# EAGLE design Tesseract_Pro-Mini (EAGLE 7.7.0)
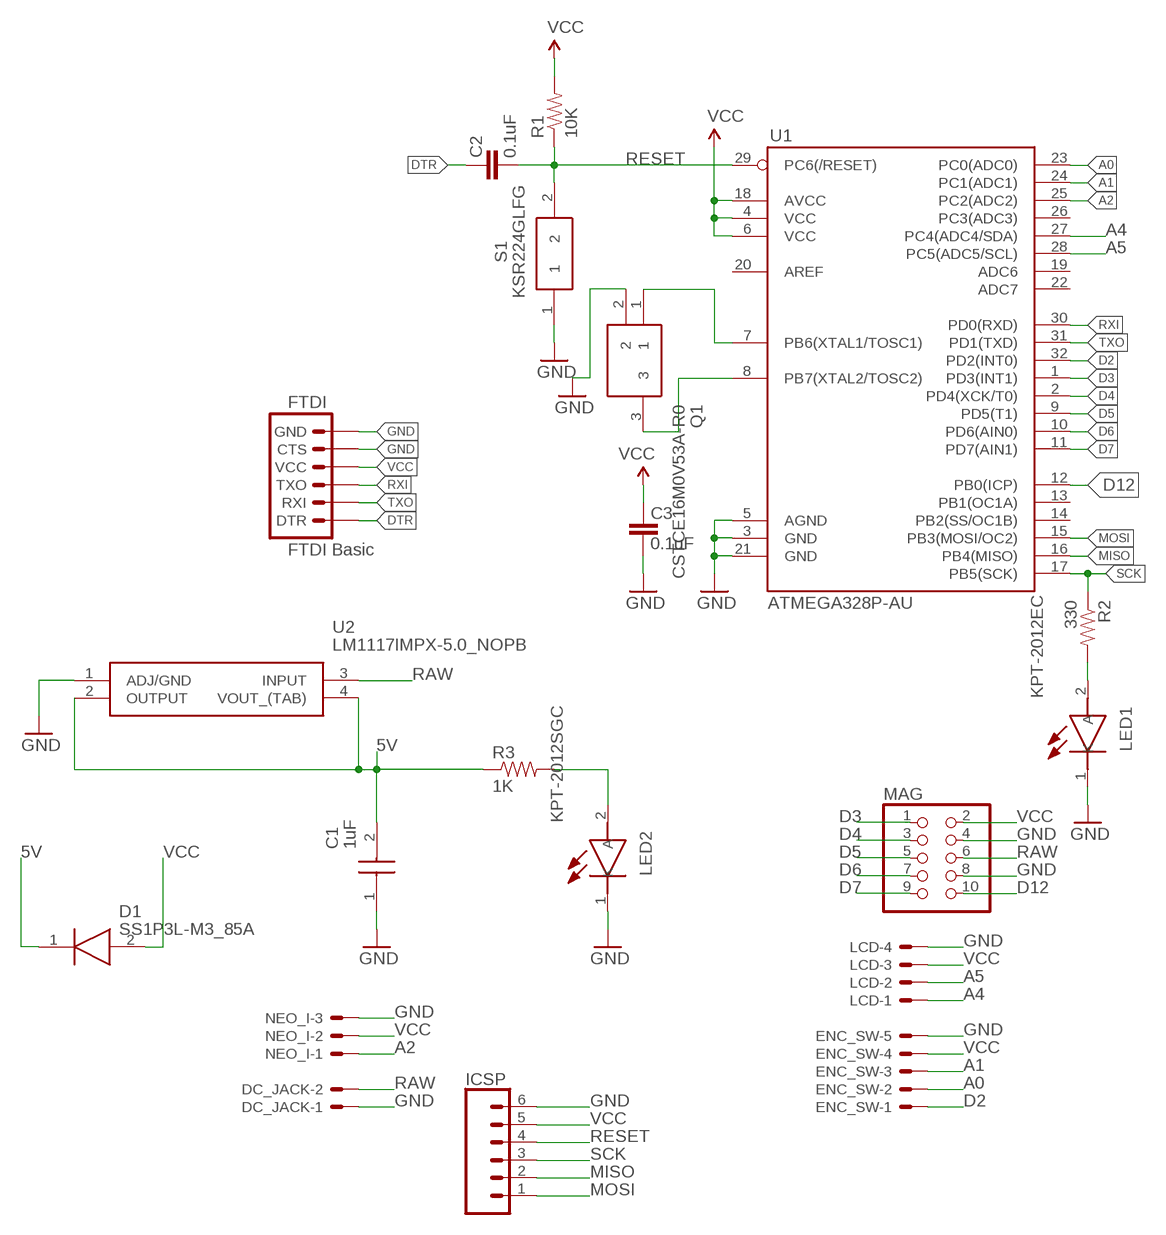
[diagram p0: schematic, sheet 1]

## Parts
C1  1uF  GRM188R61E105KA12D  [CAPC1608X90N]
C2  0.1uF  CAP0603-CAP  [0603-CAP]
C3  0.1uF  CAP0603-CAP  [0603-CAP]
D1  SS1P3L-M3_85A  [SMP]
DC_JACK  JST-XH-02-PIN-LONG-PAD  [JST-XH-02-PACKAGE-LONG-PAD]
ENC_SW  JST-XH-05-PIN-LONG-PAD  [JST-XH-05-PACKAGE-LONG-PAD]
FTDI  FTDI Basic  ARDUINO_SERIAL_PROGRAMPTH  [1X06]
ICSP  CONN_06NO_SILK_NO_POP  [1X06_NO_SILK]
LCD  JST-XH-04-PIN-LONG-PAD  [JST-XH-04-PACKAGE-LONG-PAD]
LED1  KPT-2012EC  [LEDC2012X75N]
LED2  KPT-2012SGC  [LEDM2012X120N]
MAG  PINHD-2X5  [2X05]
NEO_I  JST-XH-03-PIN-LONG-PAD  [JST-XH-03-PACKAGE-LONG-PAD]
Q1  CSTCE16M0V53A-R0  [CSTCE-V_1]
R1  10K  RESISTOR0603-RES  [0603-RES]
R2  330  RESISTOR0603-RES  [0603-RES]
R3  1K  RESISTOR0603-RES  [0603-RES]
S1  KSR224GLFG  [KSR211GLFS]
U1  ATMEGA328P-AU  ATMEGA168  [TQFP32-08]
U2  LM1117IMPX-5.0_NOPB  [SOT230P700X180-4N]

## Nets
5V: C1.2 D1.1(A) R3.1 U2.2(OUTPUT) U2.4(VOUT_(TAB))
A0: ENC_SW.2 U1.23(PC0(ADC0))
A1: ENC_SW.3 U1.24(PC1(ADC1))
A2: NEO_I.1 U1.25(PC2(ADC2))
A4: LCD.1 U1.27(PC4(ADC4/SDA))
A5: LCD.2 U1.28(PC5(ADC5/SCL))
D2: ENC_SW.1 U1.32(PD2(INT0))
D3: MAG.1 U1.1(PD3(INT1))
D4: MAG.3 U1.2(PD4(XCK/T0))
D5: MAG.5 U1.9(PD5(T1))
D6: MAG.7 U1.10(PD6(AIN0))
D7: MAG.9 U1.11(PD7(AIN1))
D12: MAG.10 U1.12(PB0(ICP))
DTR: C2.2 FTDI.1(DTR)
GND [vcc]: C1.1 C3.1 DC_JACK.1 ENC_SW.5 FTDI.5(CTS) FTDI.6(GND) ICSP.6 LCD.4 LED1.1(K) LED2.1(K) MAG.4 MAG.8 NEO_I.3 Q1.2 S1.1 U1.3(GND) U1.5(AGND) U1.21(GND) U2.1(ADJ/GND)
MISO: ICSP.2 U1.16(PB4(MISO))
MOSI: ICSP.1 U1.15(PB3(MOSI/OC2))
N$1: Q1.1 U1.7(PB6(XTAL1/TOSC1))
N$2: Q1.3 U1.8(PB7(XTAL2/TOSC2))
N$3: LED2.2(A) R3.2
N$4: LED1.2(A) R2.2
RAW [vcc]: DC_JACK.2 MAG.6 U2.3(INPUT)
RESET: C2.1 ICSP.4 R1.1 S1.2 U1.29(PC6(/RESET))
RXI: FTDI.3(TXO) U1.30(PD0(RXD))
SCK: ICSP.3 R2.1 U1.17(PB5(SCK))
TXO: FTDI.2(RXI) U1.31(PD1(TXD))
VCC: C3.2 D1.2(K) ENC_SW.4 FTDI.4(VCC) ICSP.5 LCD.3 MAG.2 NEO_I.2 R1.2 U1.4(VCC) U1.6(VCC) U1.18(AVCC)
Unconnected: U1.13(PB1(OC1A)) U1.14(PB2(SS/OC1B)) U1.19(ADC6) U1.20(AREF) U1.22(ADC7) U1.26(PC3(ADC3))

## Library data of the parts
C1 = SamacSys_Parts:GRM188R61E105KA12D: Ceramic SMT capacitor 1uF 25Vdc Murata 0603 GRM 1??F Ceramic Multilayer Capacitor, 25 V dc X5R Dielectric ??10% Source: Datasheet <http://psearch.en.murata.com/capacitor/product/GRM188R61E105KA12#.pdf>; ARROW_PART_NUMBER: GRM188R61E105KA12D; ARROW_PRICE/STOCK: https://www.arrow.com/en/products/grm188r61e105ka12d/murata-manufacturing; DESCRIPTION: Ceramic SMT capacitor 1uF 25Vdc Murata 0603 GRM 1??F Ceramic Multilayer Capacitor, 25 V dc X5R Dielectric ??10%; HEIGHT: 0.9mm; MANUFACTURER_NAME: Murata Electronics; MANUFACTURER_PART_NUMBER: GRM188R61E105KA12D; RS_PART_NUMBER: 7235587P; RS_PRICE/STOCK: http://uk.rs-online.com/web/p/products/7235587P
C2 C3 = SparkFun:CAP: Capacitor Standard 0603 ceramic capacitor, and 0.1" leaded capacitor.
D1 = SamacSys_Parts:SS1P3L-M3_85A: Schottky Diodes & Rectifiers 30volt 1.0amp Source: Datasheet <https://www.vishay.com/docs/88915/ss1p3l.pdf>; ARROW_PART_NUMBER: SS1P3L-M3/85A; ARROW_PRICE/STOCK: https://www.arrow.com/en/products/ss1p3l-m385a/vishay; DESCRIPTION: Schottky Diodes & Rectifiers 30volt 1.0amp; HEIGHT: mm; MANUFACTURER_NAME: Vishay; MANUFACTURER_PART_NUMBER: SS1P3L-M3/85A
DC_JACK = Rembrandt Electronics - JST XH Connectors v1-0:JST-XH-02-PIN: JST XH Connector 2 Pin Wire to board connector. Pitch: 2,54 mm, (0.100") Number of pins: 2 Created by Rembrandt Electronics www.rembrandtelectronics.com
ENC_SW = Rembrandt Electronics - JST XH Connectors v1-0:JST-XH-05-PIN: JST XH Connector 2 Pin Wire to board connector. Pitch: 2,54 mm, (0.100") Number of pins: 5 Created by Rembrandt Electronics www.rembrandtelectronics.com
FTDI = SparkFun:ARDUINO_SERIAL_PROGRAM
ICSP = SparkFun-Connectors:CONN_06: Multi connection point. Often used as Generic Header-pin footprint for 0.1 inch spaced/style header connections On any of the 0.1 inch spaced packages, you can populate with these: Break Away Headers - Straight <https://www.sparkfun.com/products/116> (PRT-00116) Break Away Male Headers - Right Angle <https://www.sparkfun.com/products/553> (PRT-00553) Female Headers <https://www.sparkfun.com/products/115> (PRT-00115) Break Away Headers - Machine Pin <https://www.sparkfun.com/products/117> (PRT-00117) Break Away Female Headers - Swiss Machine Pin <https://www.sparkfun.com/products/743> (PRT-00743) Arduino Stackable Header - 6 Pin <https://www.sparkfun.com/products/9280> (PRT-09280) For SCREWTERMINALS and SPRING TERMINALS visit here: Screw Terimnals on SparkFun.com <https://www.sparkfun.com/search/results?term=Screw+Terminals> (5mm/3.5mm/2.54mm spacing) This device is also useful as a general connection point to wire up your design to another part of your project. Our various solder wires solder well into these plated through hole pads. Hook-Up Wire - Assortment (Stranded, 22 AWG) <https://www.sparkfun.com/products/11375> (PRT-11375) Hook-Up Wire - Assortment (Solid Core, 22 AWG) <https://www.sparkfun.com/products/11367> (PRT-11367) View the entire wire category on our website here <https://www.sparkfun.com/categories/141>
LCD = Rembrandt Electronics - JST XH Connectors v1-0:JST-XH-04-PIN: JST XH Connector 2 Pin Wire to board connector. Pitch: 2,54 mm, (0.100") Number of pins: 4 Created by Rembrandt Electronics www.rembrandtelectronics.com
LED1 = SamacSys_Parts:KPT-2012EC: Kingbright KPT-2012EC Red LED, 617 nm, 2012 (0805), Rectangle Lens SMD Package Source: Datasheet <http://uk.rs-online.com/web/p/products/8610175>; ARROW_PART_NUMBER: KPT-2012EC; ARROW_PRICE/STOCK: http://uk.rs-online.com/web/p/products/1651842; DESCRIPTION: Kingbright KPT-2012EC Red LED, 617 nm, 2012 (0805), Rectangle Lens SMD Package; HEIGHT: 0.75mm; MANUFACTURER_NAME: Kingbright; MANUFACTURER_PART_NUMBER: KPT-2012EC; RS_PART_NUMBER: 1651842; RS_PRICE/STOCK: http://uk.rs-online.com/web/p/products/1651842
LED2 = SamacSys_Parts:KPT-2012SGC: Kingbright KPT-2012SGC Green LED, 568 nm, 2012 (0805), Rectangle Lens SMD Package Source: Datasheet <https://componentsearchengine.com/Datasheets/2/KPT-2012SGC.pdf>; ARROW_PART_NUMBER: KPT-2012SGC; ARROW_PRICE/STOCK: http://uk.rs-online.com/web/p/products/8610188; DESCRIPTION: Kingbright KPT-2012SGC Green LED, 568 nm, 2012 (0805), Rectangle Lens SMD Package; HEIGHT: 1.2mm; MANUFACTURER_NAME: Kingbright; MANUFACTURER_PART_NUMBER: KPT-2012SGC; RS_PART_NUMBER: 8610188; RS_PRICE/STOCK: http://uk.rs-online.com/web/p/products/8610188
MAG = POGO:PINHD-2X5: PIN HEADER
NEO_I = Rembrandt Electronics - JST XH Connectors v1-0:JST-XH-03-PIN: JST XH Connector 2 Pin Wire to board connector. Pitch: 2,54 mm, (0.100") Number of pins: 3 Created by Rembrandt Electronics www.rembrandtelectronics.com
Q1 = SamacSys_Parts:CSTCE16M0V53A-R0: CSTCE16M0V53A-R0, Ceramic Resonator, 16MHz Fundamental 15pF, 3-Pin Cap Chip, 3.2 x 1.3 x 0.9mm Source: Datasheet <http://docs-europe.electrocomponents.com/webdocs/0ef2/0900766b80ef2ca9.pdf>; ARROW_PART_NUMBER: CSTCE16M0V53A-R0; ARROW_PRICE/STOCK: https://www.arrow.com/en/products/cstce16m0v53a-r0/murata-manufacturing; DESCRIPTION: CSTCE16M0V53A-R0, Ceramic Resonator, 16MHz Fundamental 15pF, 3-Pin Cap Chip, 3.2 x 1.3 x 0.9mm; HEIGHT: mm; MANUFACTURER_NAME: Murata Electronics; MANUFACTURER_PART_NUMBER: CSTCE16M0V53A-R0; RS_PART_NUMBER: 1669524; RS_PRICE/STOCK: http://uk.rs-online.com/web/p/products/1669524
R1-R3 = SparkFun:RESISTOR: Resistor Basic schematic elements and footprints for 0603, 1206, and PTH resistors.
S1 = SamacSys_Parts:KSR224GLFG: KSR224GLFG (Tactile Switches) Source: Datasheet <https://www.ckswitches.com/media/1466/ksr.pdf>; ARROW_PART_NUMBER: KSR224GLFG; DESCRIPTION: KSR224GLFG (Tactile Switches); HEIGHT: mm; MANUFACTURER_NAME: C & K COMPONENTS; MANUFACTURER_PART_NUMBER: KSR224GLFG
U1 = SparkFun:ATMEGA168; DESCRIPTION: MICROCHIP - ATMEGA328P-AU. - MICROCONTROLLER MCU, 8 BIT, ATMEGA, 20MHZ, TQFP-32; MANUFACTURER: Microchip; PART_NUMBER: ATMEGA328P-AU; RS_PART_NUMBER: 1310271
U2 = SamacSys_Parts:LM1117IMPX-5.0_NOPB: Space Saving 800mA Low-Dropout Linear Regulator with Internal Current Limit Source: Datasheet <http://www.ti.com/lit/gpn/lm1117>; ARROW_PART_NUMBER: LM1117IMPX-5.0/NOPB; ARROW_PRICE/STOCK: https://www.arrow.com/en/products/lm1117impx-5.0nopb/texas-instruments; DESCRIPTION: Space Saving 800mA Low-Dropout Linear Regulator with Internal Current Limit; HEIGHT: 1.8mm; MANUFACTURER_NAME: Texas Instruments; MANUFACTURER_PART_NUMBER: LM1117IMPX-5.0/NOPB

## Net classes
0 default: width 0.203 mm
1 vcc: width 0.254 mm

## Board
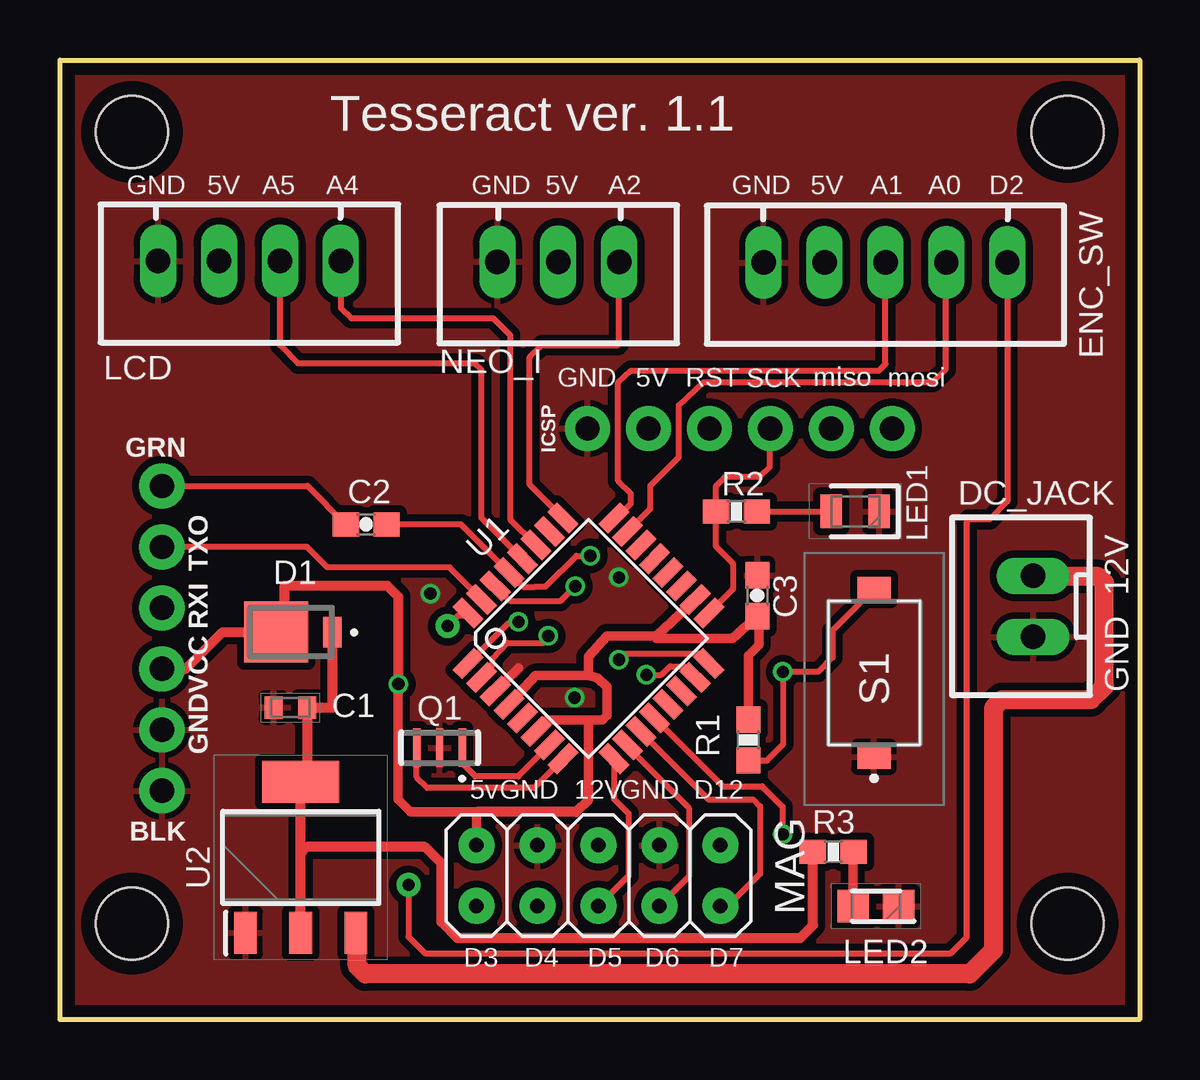
[diagram p1: board, top side]
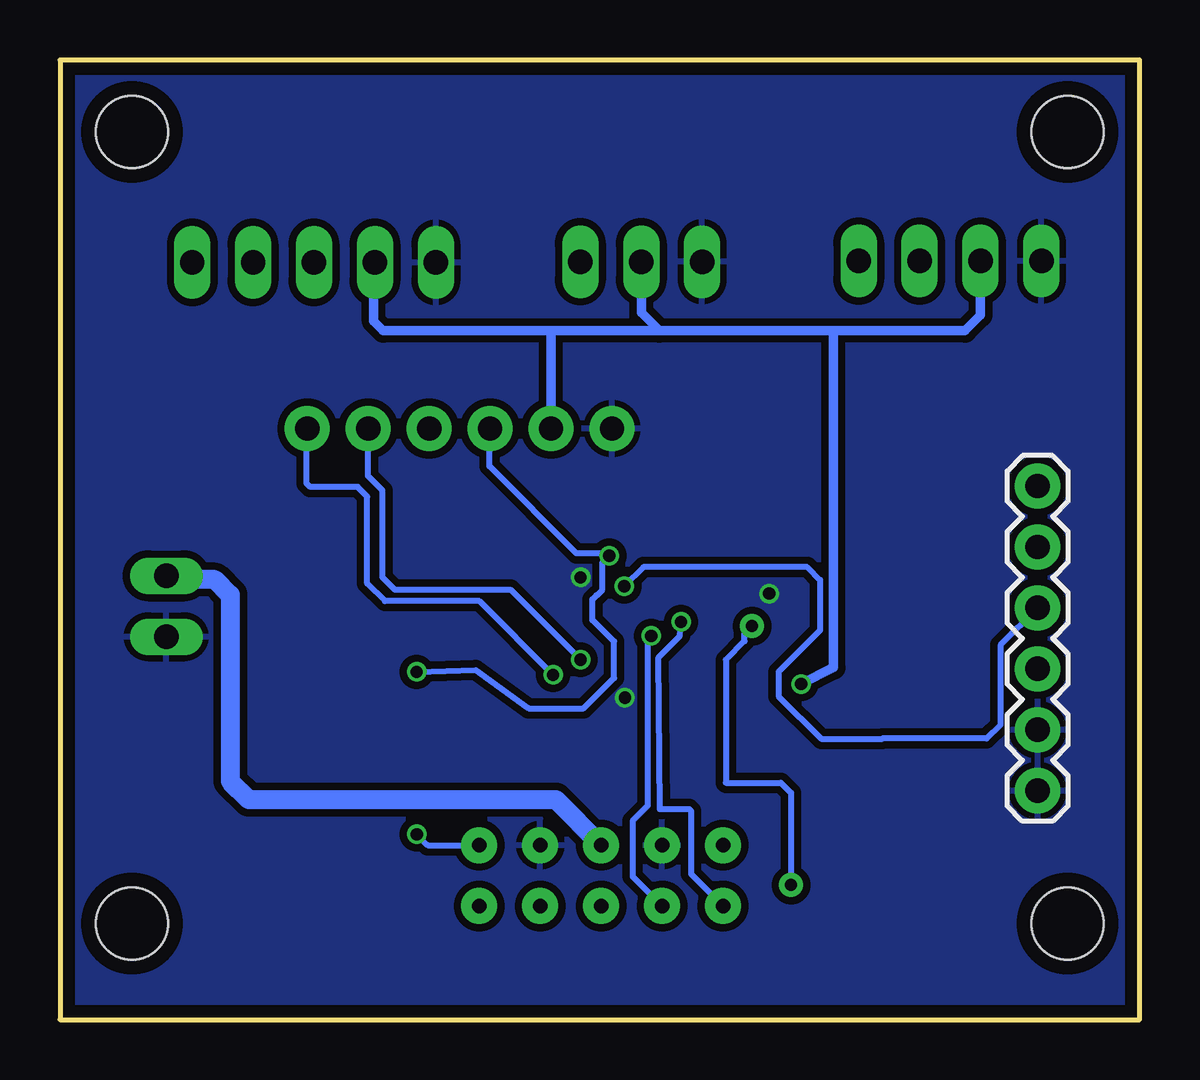
[diagram p2: board, bottom side, seen from below]

Size 45 x 40 mm. Coordinates in mm from the lower left corner, seen from the top.
Outline: 0,40 45,40 45,0 0,0 0,40
Copper layers (1*16): Top 0.035mm / dielectric 1.6mm / Bottom 0.035mm
Design rules "Elecrow_2-layer_PCB_eagle_rule": minimum track width 6mil, minimum drill 12mil, track to track 6mil, track to pad 6mil, pad to pad 6mil, via to via 8mil, smd to smd 0mil, copper to edge 20mil, drill to drill 10mil, minimum pad ring 6mil, minimum via ring 6mil, stop-mask expansion 0mil, vias tented up to drill 100mil, thermal gap 10mil
Holes 3 mm at 3,4 42,4 42,37 3,37
tRestrict: area 40.5,2.5 to 43.5,5.5; area 40.5,35.5 to 43.5,38.5; area 1.5,35.5 to 4.5,38.5; area 1.5,2.5 to 4.5,5.5
bRestrict: area 1.5,2.5 to 4.5,5.5; area 1.5,35.5 to 4.5,38.5; area 40.5,2.5 to 43.5,5.5; area 40.5,35.5 to 43.5,38.5

### Footprints (pad centres in the part's own frame; a part is rotated, then mirrored left to right if it is on the bottom)
CAPC1608X90N = smd 0.75 x 0.94: 1 -0.7,0; 2 0.7,0
0603-CAP = smd 1.1 x 1: 1 -0.85,0; 2 0.85,0
SMP = smd 0.762 x 1.27: 1 0.03,0 | smd 2.67 x 2.54: 2 -2.321,0
JST-XH-02-PACKAGE-LONG-PAD = drill 1.016 long: 1 -1.27,0; 2 1.27,0
JST-XH-05-PACKAGE-LONG-PAD = drill 1.016 long: 1 -5.08,0; 2 -2.54,0; 3 0,0; 4 2.54,0; 5 5.08,0
1X06 = drill 1.016 pad 1.88: 1 0,0; 2 2.54,0; 3 5.08,0; 4 7.62,0; 5 10.16,0; 6 12.7,0
1X06_NO_SILK = drill 1.016 pad 1.88: 1 0,0; 2 2.54,0; 3 5.08,0; 4 7.62,0; 5 10.16,0; 6 12.7,0
JST-XH-04-PACKAGE-LONG-PAD = drill 1.016 long: 1 -3.81,0; 2 -1.27,0; 3 1.27,0; 4 3.81,0
LEDC2012X75N = smd 0.9 x 1.4: 1 -1,0; 2 1,0
LEDM2012X120N = smd 1.3 x 1.35: 1 -0.95,0; 2 0.95,0
2X05 = drill 0.6 pad 1.5: 1 -5.08,-1.27; 2 -5.08,1.27; 3 -2.54,-1.27; 4 -2.54,1.27; 5 0,-1.27; 6 0,1.27; 7 2.54,-1.27; 8 2.54,1.27; 9 5.08,-1.27; 10 5.08,1.27
JST-XH-03-PACKAGE-LONG-PAD = drill 1.016 long: 1 -2.54,0; 2 0,0; 3 2.54,0
CSTCE-V_1 = smd 0.3 x 1.6: 1 -0.95,0; 2 0,0; 3 0.95,0
0603-RES = smd 1.1 x 1: 1 -0.85,0; 2 0.85,0
KSR211GLFS = smd 1 x 1.4: 1 -3.5,0; 2 3.5,0
TQFP32-08 = smd 1.27 x 0.559: 1 -4.293,2.8; 2 -4.293,2; 3 -4.293,1.2; 4 -4.293,0.4; 5 -4.293,-0.4; 6 -4.293,-1.2; 7 -4.293,-2; 8 -4.293,-2.8; 17 4.293,-2.8; 18 4.293,-2; 19 4.293,-1.2; 20 4.293,-0.4; 21 4.293,0.4; 22 4.293,1.2; 23 4.293,2; 24 4.293,2.8 | smd 0.559 x 1.27: 9 -2.8,-4.293; 10 -2,-4.293; 11 -1.2,-4.293; 12 -0.4,-4.293; 13 0.4,-4.293; 14 1.2,-4.293; 15 2,-4.293; 16 2.8,-4.293; 25 2.8,4.293; 26 2,4.293; 27 1.2,4.293; 28 0.4,4.293; 29 -0.4,4.293; 30 -1.2,4.293; 31 -2,4.293; 32 -2.8,4.293
SOT230P700X180-4N = smd 1.75 x 0.95: 1 -3.15,2.3; 2 -3.15,0; 3 -3.15,-2.3 | smd 1.75 x 3.2: 4 3.15,0

### Placement (x,y rotation side)
C1  9.6,13 0 top
C2  12.77,20.64 180 top
C3  29.07,17.67 270 top
D1  11.33,16.15 0 top
DC_JACK  40.57,17.22 90 top
ENC_SW  34.41,31.56 180 top
FTDI  4.25,22.24 270 bottom
ICSP  34.69,24.64 180 top
LCD  7.9,31.62 180 top
LED1  33.15,21.18 180 top
LED2  34.01,4.72 180 top
MAG  22.44,6 0 top
NEO_I  20.77,31.59 180 top
Q1  15.82,11.33 180 top
R1  28.69,11.65 90 top
R2  28.2,21.17 0 top
R3  32.23,6.99 0 top
S1  33.93,14.45 90 top
U1  22.03,15.89 45 top
U2  10.03,6.76 90 top

### Tracks (layer width: path | path; a pad name or v marks a point on that pad's centre or on a via)
5V
  Top 0.406: U2.2 10.03,6.93 | 10.03,6.93 U2.4 10.3,10.18 C1.2 11.36,13.01 D1.1 | 10.03,6.93 10.29,7.19 15.21,7.19 15.9,6.5 15.9,4.06 16.56,3.4 30.86,3.4 31.39,3.94 31.39,6.97 R3.1
A0
  Top 0.254: ENC_SW.2 36.93,31.54 36.93,27.1 36.39,26.57 26.84,26.57 25.8,25.6 25.8,23.44 24.61,22.25 24.61,21.3 U1.23
A1
  Top 0.254: U1.24 23.23,20.91 23.26,20.97 23.8,21.51 23.8,21.92 23.26,22.46 23.26,26.55 23.8,27.05 34.13,27.05 34.41,27.33 ENC_SW.3
A2
  Top 0.254: U1.25 19.58,22.3 19.58,27.61 20.09,28.12 23.26,28.12 23.31,28.16 NEO_I.1
A4
  Top 0.254: LCD.1 11.71,29.66 12.14,29.23 18.05,29.23 18.77,28.52 18.77,20.85 U1.27
A5
  Top 0.254: LCD.2 9.17,28.11 9.93,27.35 17.3,27.35 17.57,27.09 17.57,20.91 U1.28
D2  (via drill 0.5 pad 1)
  Top 0.254: U1.32 17.02,16.83 16.57,16.83 v16.15,16.4 | ENC_SW.1 39.49,21.59 38.76,20.85 37.89,20.85 37.79,20.75 37.8,20.75 37.8,3.43 37.11,2.74 15.24,2.74 14.53,3.45 v14.53,5.61
  Bottom 0.254: v16.15,16.4 16.46,16.09 16.46,15.77 17.24,14.99 17.24,9.88 14.96,9.88 14.53,9.45 v14.53,5.61
D3  (via drill 0.51)
  Top 0.254: 18.7,16.52 v19.11,16.57 18.7,16.52 | U1.1 18.7,16.52
  Bottom 0.254: v19.11,16.57 19.16,15.99 20.05,15.1 20,8.78 18.78,8.78 18.7,8.7 18.7,6.07 MAG.1
D4  (via drill 0.51)
  Top 0.254: U1.2 17.58,14.33 18.03,14.78 18.03,15.06 18.64,15.7 20.16,15.7 v20.35,15.99
  Bottom 0.254: v20.35,15.99 20.51,15.76 20.51,8.91 21.13,8.28 21.13,5.96 MAG.3
D5
  Top 0.254: U1.9 23.09,9.2 23.7,8.59 23.7,5.99 MAG.5
D6
  Top 0.254: U1.10 23.65,11.38 26.21,8.81 26.21,5.96 MAG.7
D7
  Top 0.254: U1.11 24.22,11.99 27.03,9.17 28.91,9.17 29.18,8.89 29.18,6.07 27.84,4.73 MAG.9
D12  (via drill 0.51)
  Top 0.254: U1.12 27.63,9.73 29.26,9.73 30.12,8.87 v30.12,7.72
  Bottom 0.254: v30.12,7.72 29.67,7.27 MAG.10
DTR
  Top 0.254: FTDI.1 10.32,22.24 C2.2
GND  (via drill 0.51)
  Top 0.4: U1.3 19.11,14.67
  other vias: 23.3,18.43 15.43,17.76 21.45,13.42
  pour Top (isolate 0.305): 0,0 0,40 45,40 45,0
  pour Bottom (isolate 0.305): 0,0 0,40 45,40 45,0
MISO  (via drill 0.51)
  Top 0.254: U1.16 26.62,15.26 23.55,15.26 v23.3,15
  Bottom 0.254: v23.3,15 26.22,17.92 31.05,17.92 31.55,18.43 31.55,22.05 32.16,22.66 ICSP.2
MOSI  (via drill 0.51)
  Top 0.254: U1.15 26.02,14.72 25.43,14.72 25.07,14.37 v24.44,14.37
  Bottom 0.254: v24.44,14.37 27.52,17.44 31.45,17.44 32.19,18.18 32.19,21.8 32.59,22.2 34.57,22.2 34.72,22.35 34.72,24.61 ICSP.1
N$1
  Top 0.254: U1.7 19.1,10.13 17.32,10.13 16.77,10.68 Q1.1
N$2
  Top 0.254: U1.8 19.75,9.65 15.32,9.65 14.87,10.09 Q1.3
N$3
  Top 0.4: LED2.2 33.06,6.96 R3.2
N$4
  Top 0.254: R2.2 29.06,21.18 LED1.2
RAW
  Top 0.8: U2.3 12.33,3.19 | DC_JACK.2 40.6,18.47 43.28,18.47 43.54,18.21 43.54,13.89 42.98,13.34 39.27,13.34 38.91,12.98 38.91,2.9 37.92,1.91 12.72,1.91 12.39,2.23 12.39,3.54 U2.3 | 12.37,3.57 U2.3
  Bottom 0.8: DC_JACK.2 40.41,18.34 38.53,18.34 37.9,17.7 37.9,9.93 37.13,9.17 24.34,9.17 MAG.6
RESET  (via drill 0.51)
  Top 0.254: v22.1,19.33 21.52,19.33 20.23,18.05 19.8,18.04 19.32,18.04 U1.29 16.71,20.64 C2.1 | S1.2 32.21,16.23 32.21,15.09 31.61,14.49 v30.13,14.49 30.15,14.48 30.15,11.48 29.47,10.8 R1.1
  Bottom 0.254: v30.13,14.49 27.67,14.57 25.46,12.97 23.17,12.97 21.9,14.24 21.9,15.76 21.91,15.76 22.8,16.66 22.8,17.52 22.64,17.68 22.62,17.68 22.39,17.91 22.39,19.05 v22.1,19.33 22.2,19.43 23.47,19.43 27.1,23.06 27.1,24.61 ICSP.4
RXI  (via drill 0.51)
  Top 0.254: U1.30 18.77,17.45 20.87,17.45 21.46,18.04 v21.48,18.07
  Bottom 0.254: FTDI.3 5.8,15.61 5.8,12.29 6.38,11.71 10.72,11.71 10.73,11.7 13.27,11.7 15.04,13.48 15.04,14.49 13.32,16.22 13.32,18.33 13.85,18.86 20.69,18.86 v21.48,18.07
SCK
  Top 0.254: ICSP.3 29.59,24.61 29.59,23.04 29.18,22.63 27.74,22.63 27.35,22.25 R2.1 27.35,19.71 28.07,19 28.07,17.97 U1.17
TXO
  Top 0.254: U1.31 16.25,18.85 11.15,18.85 10.3,19.7 FTDI.2
VCC  (via drill 0.51)
  Top 0.254: 24.86,15.89 24.91,15.94 24.95,15.89 | U1.6 20.3,12.5 | 18.69,13.14 U1.4 18.51,13.14 | 22.03,12.43 22.03,12.5
  Top 0.4: 24.86,16 22.79,16 22.03,15.13 22.03,14.34 | 22.03,14.34 22.41,14.24 22.79,13.86 22.79,12.68 22.61,12.5 22.03,12.5 | 22.03,14.34 19.81,14.34 U1.4 | 22.03,12.5 20.3,12.5 | U1.18 24.86,16 | MAG.2 17.36,8.65 14.62,8.65 14.1,9.17 14.1,13.98 v14.11,13.98 | 24.86,16 24.86,15.89 28.04,15.89 C3.2 29.13,16.75 29.13,15.62 28.69,15.18 R1.2 | 22.03,12.5 22.03,9.17
  Top 0.406: FTDI.4 5.25,14.62 6.78,16.15 D1.2 9.37,16.15 9.37,18.09 13.64,18.09 14.1,17.63 14.1,13.99 v14.11,13.98 | 17.36,8.65 21.51,8.65 22.03,9.17
  Bottom 0.254: NEO_I.2 | 31.92,31.51 ENC_SW.4 | 24.53,28.51 24.74,28.71
  Bottom 0.4: v14.11,13.98 12.76,14.67 12.76,28.71 12.75,28.71 | LCD.3 6.63,29.36 7.28,28.71 12.75,28.71 | 12.75,28.71 20.01,28.71 | 20.01,28.71 20.77,29.47 NEO_I.2 | 20.01,28.71 24.74,28.71 31.52,28.71 31.92,29.11 31.92,31.51 | ICSP.5 24.53,28.51

### Text on the board
tPlace: Tesseract ver. 1.1 | GRN | BLK
tNames: GND | 5V | A5 | A4 | GND | 5V | A2 | GND | 5V | A1 | A0 | D2 | GND | 5V | RST | SCK | miso | mosi | 12V | TXO | GND | RXI | VCC | GND | 5v | GND | 12V | GND | D12 | D3 | D4 | D5 | D6 | D7